# EAGLE design MiSTer Direct Video to Comp Adapter (EAGLE 7.1.0)
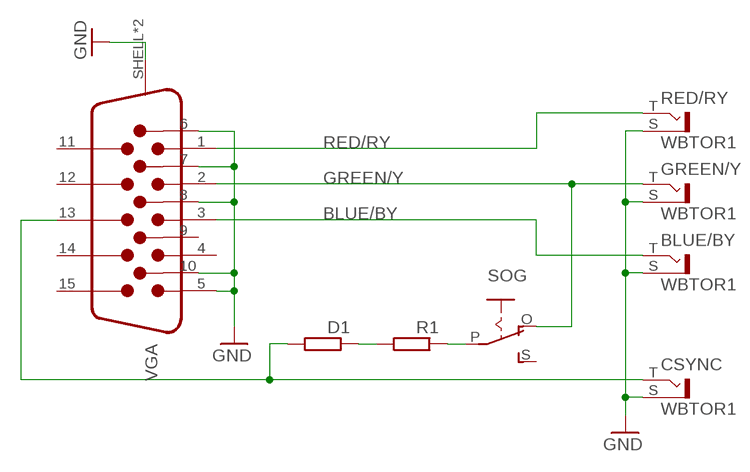
[diagram p0: schematic, sheet 1]

## Parts
BLUE/BY  WBTOR1  [WBTOR1]
CSYNC  WBTOR1  [WBTOR1]
D1  R-EU_R1206  [R1206]
GREEN/Y  WBTOR1  [WBTOR1]
R1  R-EU_R0603  [R0603]
RED/RY  WBTOR1  [WBTOR1]
SOG  EG1218S  [EG1218]
VGA  618015331023  [618015331023]

## Nets
BLUE/BY: BLUE/BY.T VGA.3
GND: BLUE/BY.S CSYNC.S GREEN/Y.S RED/RY.S VGA.5 VGA.6 VGA.7 VGA.8 VGA.10 VGA.SHELL1(SHIELD) VGA.SHELL(SHIELD)
GREEN/Y: GREEN/Y.T SOG.O VGA.2
N$1: CSYNC.T D1.2 VGA.13
N$2: D1.1 R1.2
N$3: R1.1 SOG.P
RED/RY: RED/RY.T VGA.1
Unconnected: SOG.S VGA.4 VGA.9 VGA.11 VGA.12 VGA.14 VGA.15

## Library data of the parts
BLUE/BY CSYNC GREEN/Y RED/RY = con-lumberg:WBTOR1: RCA connectors according to JEITA RC-5231 Cinch RCA-Einbaukupplung nach JEITA RC-5231, abgewinkelte Ausführung Source: http://www.lumberg.de/Produkte/PDFs/WBTOR1.pdf; MPN: WBTOR 1 BLACK; OC_FARNELL: 1200146; OC_NEWARK: 98K2588
D1 R1 = rcl:R-EU_: RESISTOR, European symbol
SOG = adafruit:EG1218: SLIDING SWITCH 0.1" spacing through hole, vertical SPDT slide switch http://www.ladyada.net/library/pcb/eaglelibrary.html
VGA = con-wurth:618015331023: WR-DSUB Male High Density Angled PCB Connector with Hex Screw, 15 Pins=>Code : Con_I-O_DSUB_PCB_Male_w-screw_618015331023 <http://katalog.we-online.de/media/images/eican/Con_I-O_DSUB_PCB_Male_w-screw_6180xx331023_pf2.jpg> Details see: http://katalog.we-online.de/en/em/DSUB_MALE_HIGH_DENSITY_ANGLED_PCB_CONNECTOR_W_HEX_SCREW_6180XX331023 Created 2014-07-10, Karrer Zheng 2014 (C) Würth Elektronik

## Board
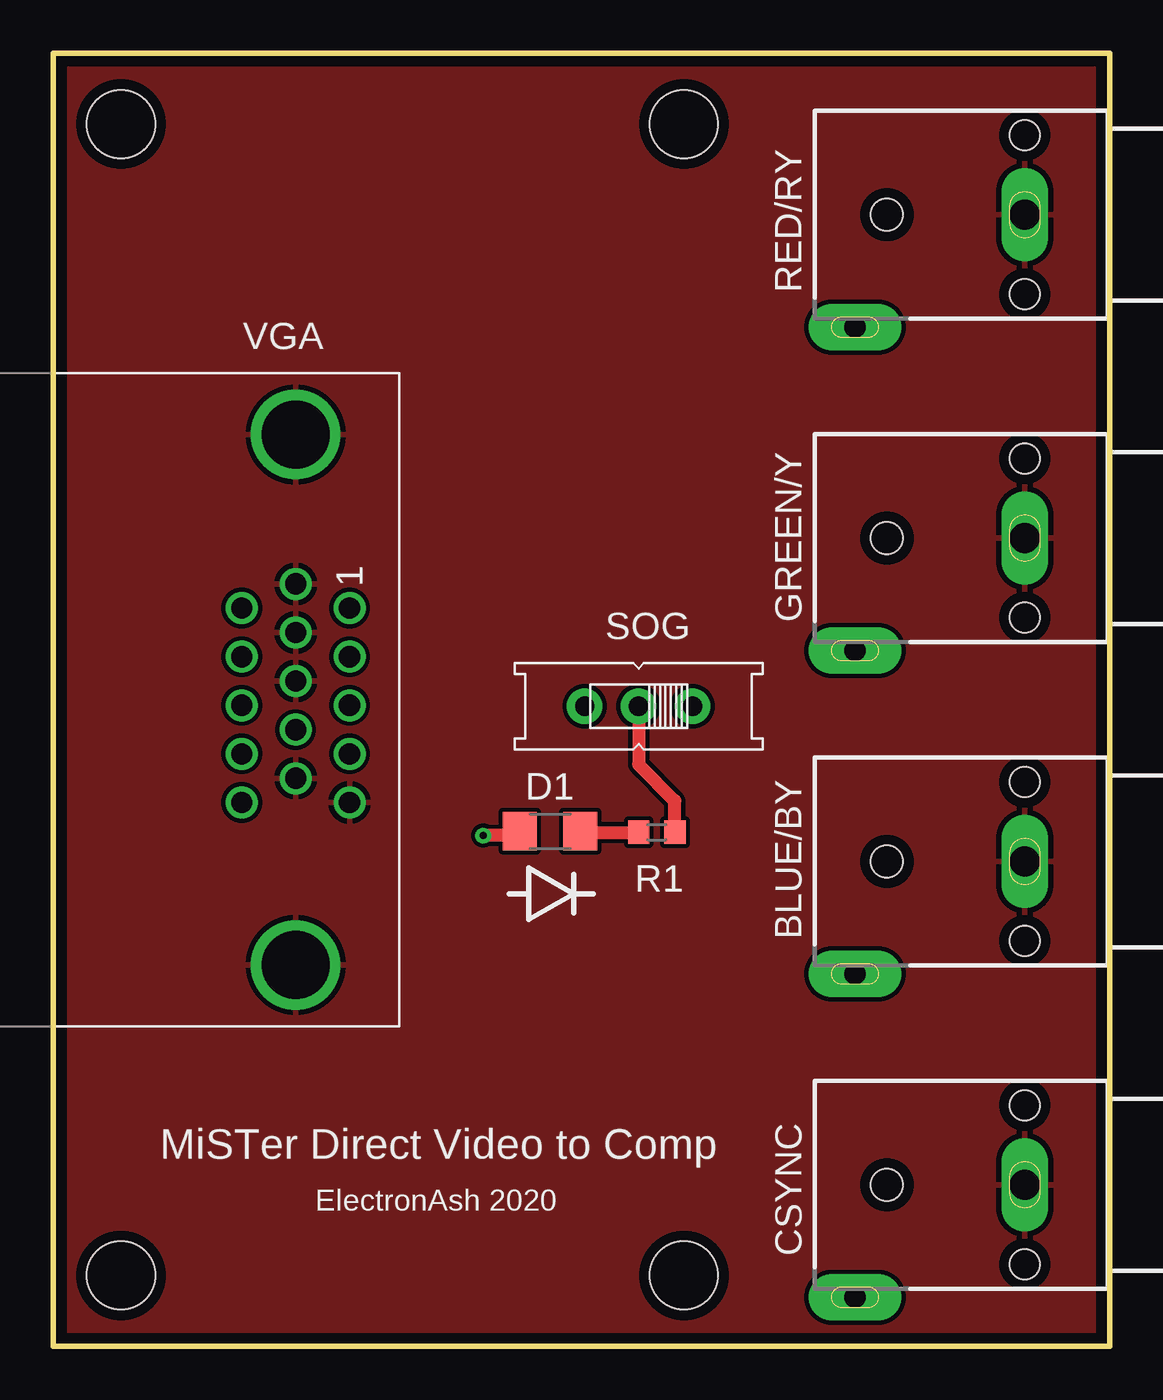
[diagram p1: board, top side]
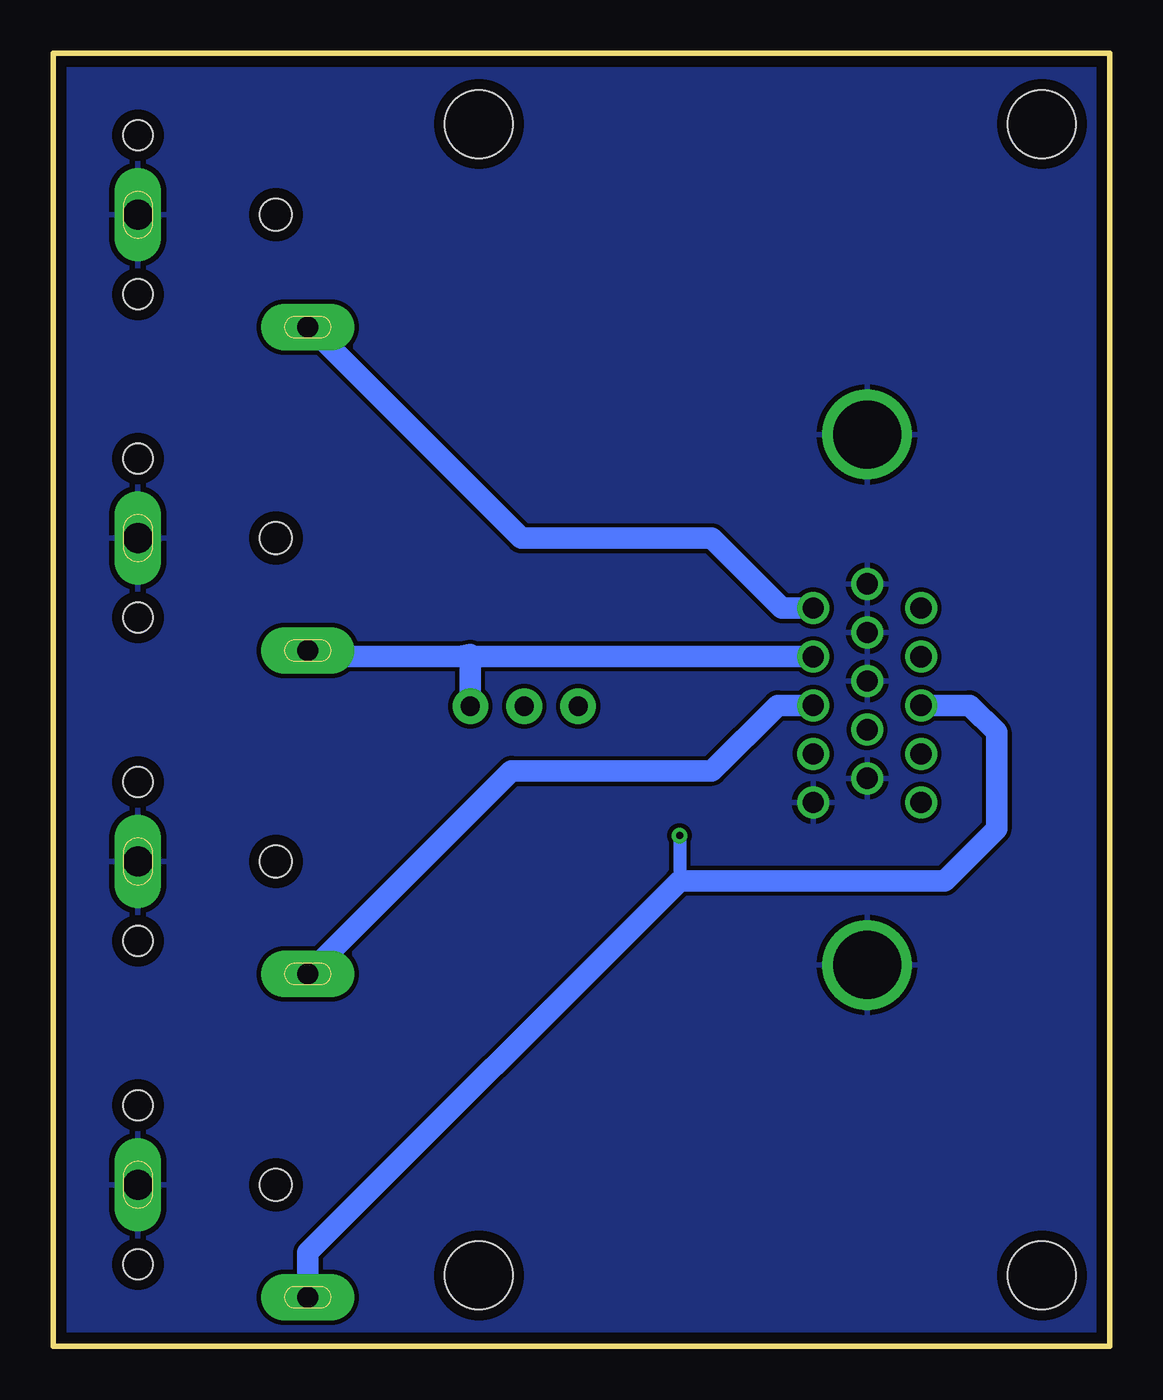
[diagram p2: board, bottom side, seen from below]

Size 49.78 x 60.96 mm. Coordinates in mm from the lower left corner, seen from the top.
Outline: 49.78,60.96 0,60.96 0,0 49.78,0 49.78,60.96
Copper layers (1*16): Top 0.035mm / dielectric 1.5mm / Bottom 0.035mm
Design rules "default *": minimum track width 10mil, minimum drill 24mil, track to track 8mil, track to pad 8mil, pad to pad 8mil, via to via 8mil, smd to smd 8mil, copper to edge 20mil, drill to drill 8mil, minimum pad ring 10mil, minimum via ring 8mil, stop-mask expansion 4mil, vias tented up to drill 0mil, thermal gap 10mil
Holes 3.2 mm at 3.2,57.61 3.2,3.35 29.72,3.35 29.72,57.61

### Footprints (pad centres in the part's own frame; a part is rotated, then mirrored left to right if it is on the bottom)
WBTOR1 = drill 1.4 pad 2.2 long: S 0,-4 | drill 1 pad 2.2 long: T 5.3,-12 | hole 1.4: -3.75,-4; 3.75,-4 | hole 1.5: 0,-10.5
R1206 = smd 1.6 x 1.803: 1 -1.422,0; 2 1.422,0
R0603 = smd 1 x 1.1: 1 -0.85,0; 2 0.85,0
EG1218 = drill 0.9 pad 1.676: O -2.54,0; P 0,0; S 2.54,0
618015331023 = drill 1: 1 -4.32,2.54; 2 -2.03,2.54; 3 0.26,2.54; 4 2.55,2.54; 5 4.84,2.54; 6 -5.46,0; 7 -3.17,0; 8 -0.88,0; 9 1.41,0; 10 3.7,0; 11 -4.32,-2.54; 12 -2.03,-2.54; 13 0.26,-2.54; 14 2.55,-2.54; 15 4.84,-2.54 | drill 3.2: SHELL -12.5,0; SHELL1 12.5,0

### Placement (x,y rotation side)
BLUE/BY  49.78,22.86 270 top
CSYNC  49.78,7.62 270 top
D1  23.42,24.28 180 top
GREEN/Y  49.78,38.1 270 top
R1  28.45,24.23 180 top
RED/RY  49.78,53.34 270 top
SOG  27.58,30.18 180 top
VGA  11.43,30.48 270 top

### Tracks (layer width: path | path; a pad name or v marks a point on that pad's centre or on a via)
BLUE/BY
  Bottom 1.016: BLUE/BY.T 37.76,17.56 28.19,27.13 18.75,27.13 15.65,30.22 VGA.3
GND
  pour Top: 0,60.96 49.78,60.96 49.78,0 0,0
  pour Bottom: 0,60.96 49.78,60.96 49.78,0 0,0
GREEN/Y
  Bottom 1.016: VGA.2 30.63,32.51 | 30.63,32.51 37.49,32.51 GREEN/Y.T | SOG.O 30.12,32.61 30.63,32.51
N$1  (via drill 0.33)
  Top 0.61: D1.2 21.79,24.08 v20.27,24.08
  Bottom 0.61: v20.27,24.08 20.27,21.95
  Bottom 1.016: VGA.13 6.6,30.22 5.33,28.96 5.33,24.38 7.77,21.95 20.27,21.95 37.78,4.43 CSYNC.T
N$2
  Top 0.61: D1.1 24.89,24.23 R1.2
N$3
  Top 0.61: SOG.P 27.58,27.43 29.3,25.72 R1.1
RED/RY
  Bottom 1.016: RED/RY.T 37.68,48.04 27.74,38.1 18.75,38.1 15.45,34.8 VGA.1

### Text on the board
tPlace: MiSTer Direct Video to Comp | ElectronAsh 2020